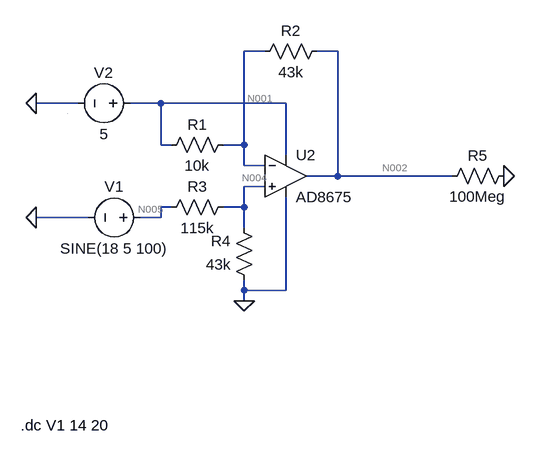
[diagram p0: schematic circuit.asc]
circuit.asc, the LTspice schematic file:
Version 4
SHEET 1 880 680
WIRE 304 -96 272 -96
WIRE 416 -96 384 -96
WIRE 16 -16 -48 -16
WIRE 144 -16 96 -16
WIRE 336 -16 144 -16
WIRE 144 48 144 -16
WIRE 160 48 144 48
WIRE 272 48 272 -96
WIRE 272 48 240 48
WIRE 336 64 336 -16
WIRE 272 80 272 48
WIRE 304 80 272 80
WIRE 416 96 416 -96
WIRE 416 96 368 96
WIRE 592 96 416 96
WIRE 304 112 272 112
WIRE 160 144 144 144
WIRE 272 144 272 112
WIRE 272 144 240 144
WIRE 32 160 -48 160
WIRE 144 160 144 144
WIRE 144 160 112 160
WIRE 272 176 272 144
WIRE 272 272 272 256
WIRE 336 272 336 128
WIRE 336 272 272 272
WIRE 272 288 272 272
WIRE 0 0 0 0
FLAG 272 288 0
FLAG -48 160 0
FLAG -48 -16 0
FLAG 672 96 0
SYMBOL voltage 128 160 R90
WINDOW 0 -32 56 VBottom 2
WINDOW 3 32 56 VTop 2
WINDOW 123 0 0 Left 0
WINDOW 39 0 0 Left 0
SYMATTR InstName V1
SYMATTR Value SINE(18 5 100)
SYMBOL voltage 112 -16 R90
WINDOW 0 -32 56 VBottom 2
WINDOW 3 32 56 VTop 2
WINDOW 123 0 0 Left 0
WINDOW 39 0 0 Left 0
SYMATTR InstName V2
SYMATTR Value 5
SYMBOL res 256 32 R90
WINDOW 0 0 56 VBottom 2
WINDOW 3 32 56 VTop 2
SYMATTR InstName R1
SYMATTR Value 10k
SYMBOL res 400 -112 R90
WINDOW 0 0 56 VBottom 2
WINDOW 3 32 56 VTop 2
SYMATTR InstName R2
SYMATTR Value 43k
SYMBOL res 256 128 R90
WINDOW 0 0 56 VBottom 2
WINDOW 3 32 56 VTop 2
SYMATTR InstName R3
SYMATTR Value 115k
SYMBOL res 288 272 R180
WINDOW 0 36 76 Left 2
WINDOW 3 36 40 Left 2
SYMATTR InstName R4
SYMATTR Value 43k
SYMBOL OpAmps\\AD8675 336 32 R0
SYMATTR InstName U2
SYMBOL res 688 80 R90
WINDOW 0 0 56 VBottom 2
WINDOW 3 32 56 VTop 2
SYMATTR InstName R5
SYMATTR Value 100Meg
TEXT -72 480 Left 2 !.dc V1 14 20

The netlist it stands for:
* circuit.asc
V1 N005 0 SINE(18 5 100)
V2 N003 0 5
R1 N001 N003 10k
R2 N002 N001 43k
R3 N004 N005 115k
R4 0 N004 43k
XU2 N004 N001 N003 0 N002 AD8675  ; pins In+ In- V+ V- OUT
R5 0 N002 100Meg
.dc V1 14 20
.backanno
.end

* Results of the author's LTspice run, read from the files saved beside the schematic
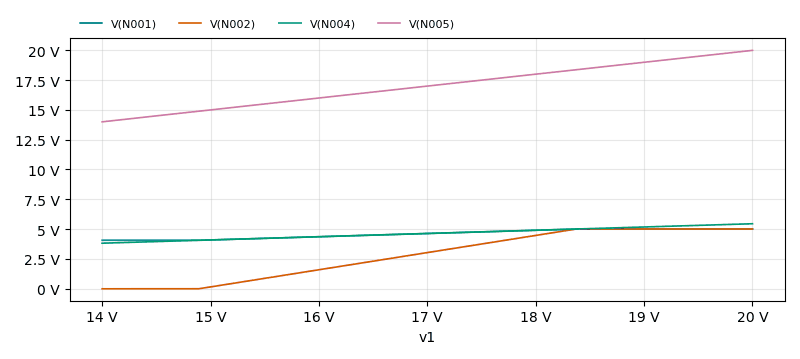
[diagram p1: DC transfer characteristic of circuit.asc, plotted from the saved traces]
* DC transfer characteristic, 1 run:
*   V(N001): 4.053 V at v1=14 V, 5 V at v1=20 V, min 4.053 V, max 5 V
*   V(N002): -18.73 mV at v1=14 V, 5.001 V at v1=20 V, min -18.73 mV, max 5.001 V
*   V(N004): 3.81 V at v1=14 V, 5.443 V at v1=20 V, min 3.81 V, max 5.443 V
*   V(N005): 14 V at v1=14 V, 20 V at v1=20 V, min 14 V, max 20 V